# Altium schematic sheet MyFly2.SchDoc: MyFly
size A4; Author: Xuedong; Organization: Altium Limited; DocumentNumber: 2; Revision: V1.0; SheetNumber: 2; SheetTotal: 2
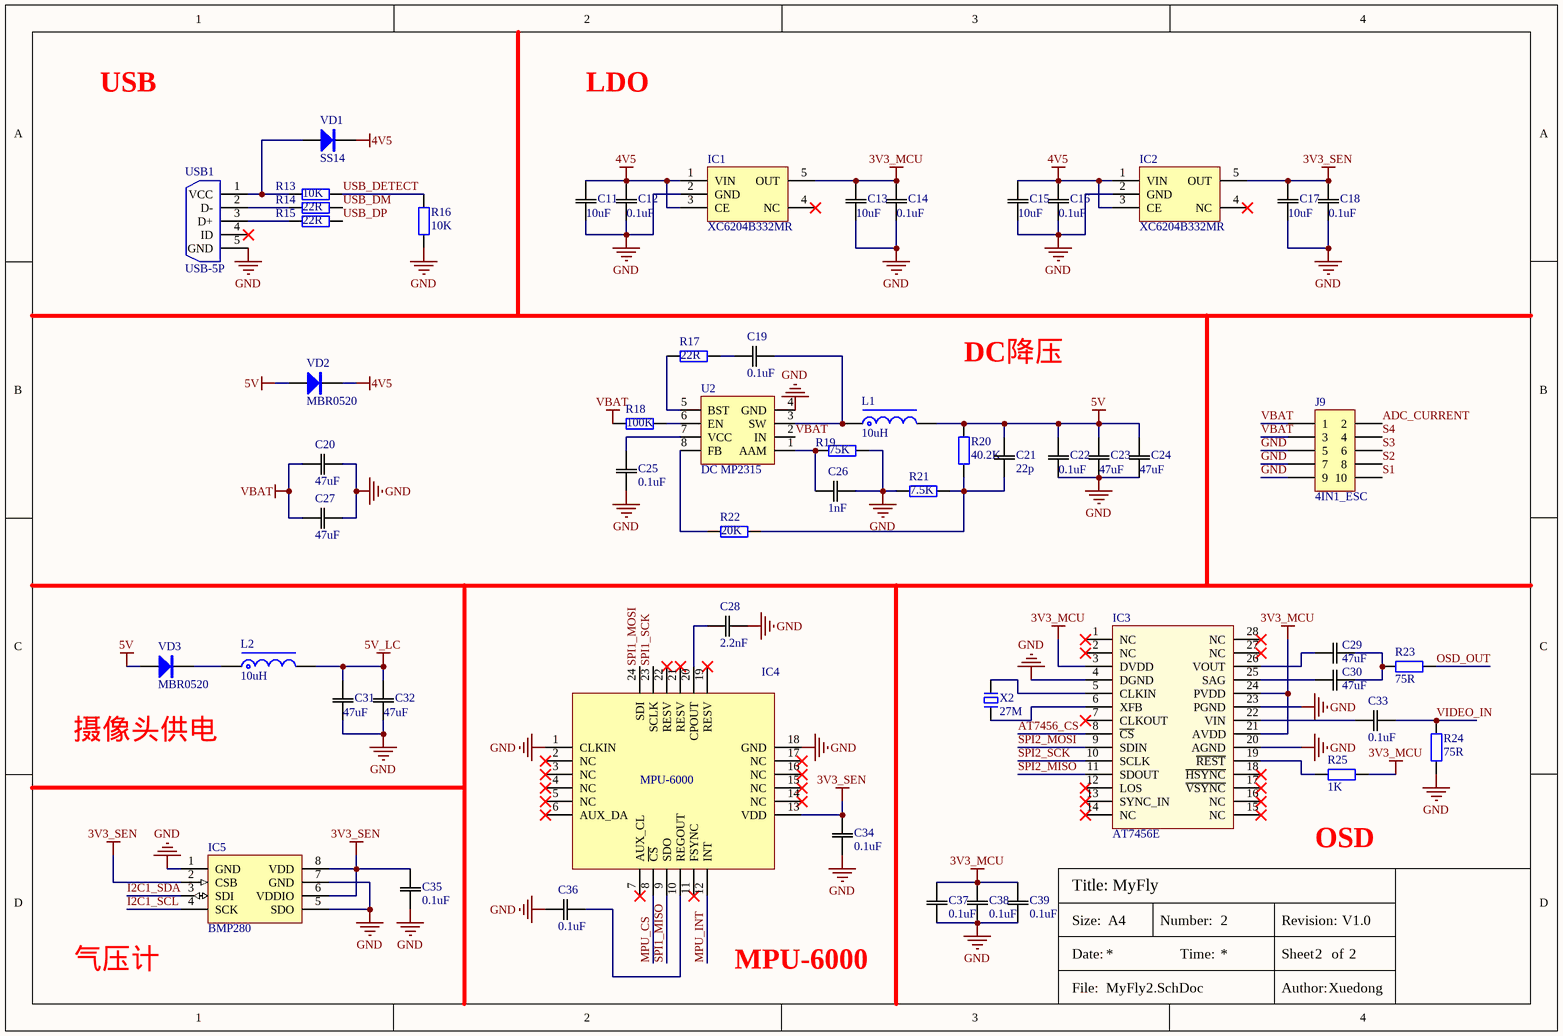
[diagram p0: MyFly2.SchDoc]

## Parts
C11  10uF  [CAP_0603]
C12  0.1uF  [CAP_0603]
C13  10uF  [CAP_0603]
C14  0.1uF  [CAP_0603]
C15  10uF  [CAP_0603]
C16  0.1uF  [CAP_0603]
C17  10uF  [CAP_0603]
C18  0.1uF  [CAP_0603]
C19  0.1uF  [CAP_0603]
C20  47uF  [CAP_1206]
C21  22p  [CAP_0603]
C22  0.1uF  [CAP_0603]
C23  47uF  [CAP_1206]
C24  47uF  [CAP_1206]
C25  0.1uF  [CAP_0603]
C26  1nF  [CAP_0603]
C27  47uF  [CAP_1206]
C28  2.2nF  [CAP_0402]
C29  47uF  [CAP_0805]
C30  47uF  [CAP_0805]
C31  47uF  [CAP_0805]
C32  47uF  [CAP_0805]
C33  0.1uF  [CAP_0402]
C34  0.1uF  [CAP_0402]
C35  0.1uF  [CAP_0603]
C36  0.1uF  [CAP_0402]
C37  0.1uF  [CAP_0402]
C38  0.1uF  [CAP_0402]
C39  0.1uF  [CAP_0402]
IC1  XC6204B332MR  [SOT23-5L]
IC2  XC6204B332MR  [SOT23-5L]
IC3  AT7456E  [TSSOP28_L_E]
IC4  MPU-6000  [QFN24 4X4_N]
IC5  BMP280  [BMP280 LGA8]
J9  4IN1_ESC  [HDR1.27 2x5-SMD]
L1  10uH  [L-SMD-0420]
L2  10uH  [NR3015]
R13  10K  [Res_0402]
R14  22R  [Res_0402]
R15  22R  [Res_0402]
R16  10K  [Res_0402]
R17  22R  [RES_0603]
R18  100K  [RES_0603]
R19  75K  [RES_0603]
R20  40.2K  [RES_0603]
R21  7.5K  [RES_0603]
R22  20K  [RES_0603]
R23  75R  [Res_0402]
R24  75R  [Res_0402]
R25  1K  [Res_0402]
U2  DC MP2315  [SOT23-8L]
USB1  USB-5P  [USB-MICRO_E]
VD1  SS14  [SOD-123]
VD2  MBR0520  [SOD-123]
VD3  MBR0520  [SOD-123]
X2  27M  [XTAL-3225]

## Nets
3V3_MCU: C13.2(EPAD) C14.2(EPAD) C37.2(EPAD) C38.2(EPAD) C39.2(EPAD) IC1.5(OUT) IC3.3(DVDD) IC3.21(AVDD) IC3.24(PVDD) R25.2
3V3_SEN: C17.2(EPAD) C18.2(EPAD) C34.2(EPAD) C35.2(EPAD) IC2.5(OUT) IC4.13(VDD) IC5.2(CSB) IC5.6(VDDIO) IC5.8(VDD)
4V5: C11.2(EPAD) C12.2(EPAD) C15.2(EPAD) C16.2(EPAD) IC1.1(VIN) IC1.3(CE) IC2.1(VIN) IC2.3(CE) VD1.2(K) VD2.2(K)
5V: C21.2(EPAD) C22.2(EPAD) C23.2(EPAD) C24.2(EPAD) L1.2 R20.2 VD2.1(A) VD3.1(A)
5V_LC: C31.2(EPAD) C32.2(EPAD) L2.2
GND: C11.1(EPAD) C12.1(EPAD) C13.1(EPAD) C14.1(EPAD) C15.1(EPAD) C16.1(EPAD) C17.1(EPAD) C18.1(EPAD) C20.1(EPAD) C22.1(EPAD) C23.1(EPAD) C24.1(EPAD) C25.1(EPAD) C26.2(EPAD) C27.1(EPAD) C28.2(EPAD) C31.1(EPAD) C32.1(EPAD) C34.1(EPAD) C35.1(EPAD) C36.1(EPAD) C37.1(EPAD) C38.1(EPAD) C39.1(EPAD) IC1.2(GND) IC2.2(GND) IC3.4(DGND) IC3.20(AGND) IC3.23(PGND) IC4.1(CLKIN) IC4.18(GND) IC5.1(GND) IC5.5(SDO) IC5.7(GND) J9.5 J9.7 J9.9 R16.1 R19.2 R21.1 R24.1 U2.4(GND) USB1.5(GND)
VBAT: C20.2(EPAD) C27.2(EPAD) J9.1 J9.3 R18.1 U2.2(IN)
ADC_CURRENT: J9.2
AT7456_CS: IC3.8(~{CS})
I2C1_SCL: IC5.4(SCK)
I2C1_SDA: IC5.3(SDI)
MPU_CS: IC4.8(~{CS})
MPU_INT: IC4.12(INT)
OSD_OUT: R23.2
S1: J9.10
S2: J9.8
S3: J9.6
S4: J9.4
SPI1_MISO: IC4.9(SDO)
SPI1_MOSI: IC4.24(SDI)
SPI1_SCK: IC4.23(SCLK)
SPI2_MISO: IC3.11(SDOUT)
SPI2_MOSI: IC3.9(SDIN)
SPI2_SCK: IC3.10(SCLK)
USB_DETECT: R13.2 R16.2
USB_DM: R14.2
USB_DP: R15.2
VIDEO_IN: C33.2(EPAD) R24.2
NetC19_1: C19.1(EPAD) R17.2
NetC19_2: C19.2(EPAD) L1.1 U2.3(SW)
NetC21_1: C21.1(EPAD) R20.1 R21.2 R22.2
NetC25_2: C25.2(EPAD) U2.7(VCC)
NetC26_1: C26.1(EPAD) R19.1 U2.1(AAM)
NetC28_1: C28.1(EPAD) IC4.20(CPOUT)
NetC29_1: C29.1(EPAD) IC3.26(VOUT)
NetC29_2: C29.2(EPAD) C30.2(EPAD) R23.1
NetC30_1: C30.1(EPAD) IC3.25(SAG)
NetC33_1: C33.1(EPAD) IC3.22(VIN)
NetC36_2: C36.2(EPAD) IC4.10(REGOUT)
NetIC3_5: IC3.5(CLKIN) X2.3
NetIC3_6: IC3.6(XFB) X2.1
NetIC3_19: IC3.19(~{REST}) R25.1
NetL2_1: L2.1 VD3.2(K)
NetR13_1: R13.1 USB1.1(VCC) VD1.1(A)
NetR14_1: R14.1 USB1.2(D-)
NetR15_1: R15.1 USB1.3(D+)
NetR17_1: R17.1 U2.5(BST)
NetR18_2: R18.2 U2.6(EN)
NetR22_1: R22.1 U2.8(FB)

Not connected (* = marked no-connect by the designer): IC1 4(NC)*; IC2 4(NC)*; IC3 1(NC)* 2(NC)* 7(CLKOUT)* 12(LOS)* 13(SYNC_IN)* 14(NC)* 15(NC)* 16(NC)* 17(~{VSYNC})* 18(~{HSYNC})* 27(NC)* 28(NC)*; IC4 2(NC)* 3(NC)* 4(NC)* 5(NC)* 6(AUX_DA)* 7(AUX_CL)* 11(FSYNC)* 14(NC)* 15(NC)* 16(NC)* 17(NC)* 19(RESV)* 21(RESV)* 22(RESV)*; USB1 4(ID)*

## Notes on the sheet
- USB
- LDO
- DC降压
- (near VD3) 摄像头供电
- (near R25) OSD
- 气压计
- MPU-6000
- Title:
- Size:  A4
- Number:
- Revision:
- Date:
- Time:
- Sheet     of
- File:
- Author:

## Library data of the parts
C11-C39 = CAP: 无极性贴片电容; Manufacturer_Part_Number: 04023A0R3BAT2A; Vendor: AVX Corporation; Built_By: EMA_UL_Team; Type: DEV; C: Copyright (C) 2016 Accelerated Designs. All rights reserved; Copyright: Copyright (C) 2016 Accelerated Designs. All rights reserved; RefDes: RefDes; Value: Value
IC1 IC2 = LDO XC6204: LDO; BOM名称: 稳压芯片; 版权归属: 源创客; 学习资源: www.ooocke.com
IC3 = AT7456E: OSD芯片
IC4 = MPU-6000: 传感器; ComponentLink1Description: 供应商链接; ComponentLink1URL: http://www.szlcsc.com/product/details_24852.html; Package: QFN-24_4x4x05P; Supplier: LC; SuppliersPartNumber: C24112
IC5 = BMP280: 气压传感器
J9 = Header_2x5: 2x5P-接插件; Manufacturer_Part_Number: 826656-5; Vendor: TE Connectivity; Built_By: EMA_UL_Team; C: Copyright (C) 2015 Accelerated Designs. All rights reserved; RefDes: RefDes; Type: DEV; Value: Value
L1 = L-CDRH: 功率屏蔽电感; 版权归属: 源创客; BOM名称: 功率屏蔽电感; 学习资源: www.ooocke.com
L2 = L-NR: NR功率电感; 版权归属: 源创客; BOM名称: NR功率电感; 学习资源: www.ooocke.com
R13-R25 = RES: 贴片电阻; Manufacturer_Part_Number: RC0402FR-070RL; Vendor: Yageo; Built_By: EMA_UL_Team; C: Copyright (C) 2015 Accelerated Designs. All rights reserved; RefDes: RefDes; Type: DEV; Value: Value
U2 = DC MP2315: DC降压芯片
USB1 = USB-5P: 微型USB母座; 版权归属: 源创客; BOM名称: 微型USB母座; 学习资源: www.ooocke.com
VD1-VD3 = SS14: 肖特基二极管; 版权归属: 源创客; 属性: 40V/1A; BOM名称: 肖特基二极管; 学习资源: www.ooocke.com
X2 = XTAL-4P: 4脚无源晶振; BOM名称: 4脚晶振; 版权归属: 源创客; 学习资源: www.ooocke.com